# Altium schematic sheet BPDC mid.SchDoc
size A
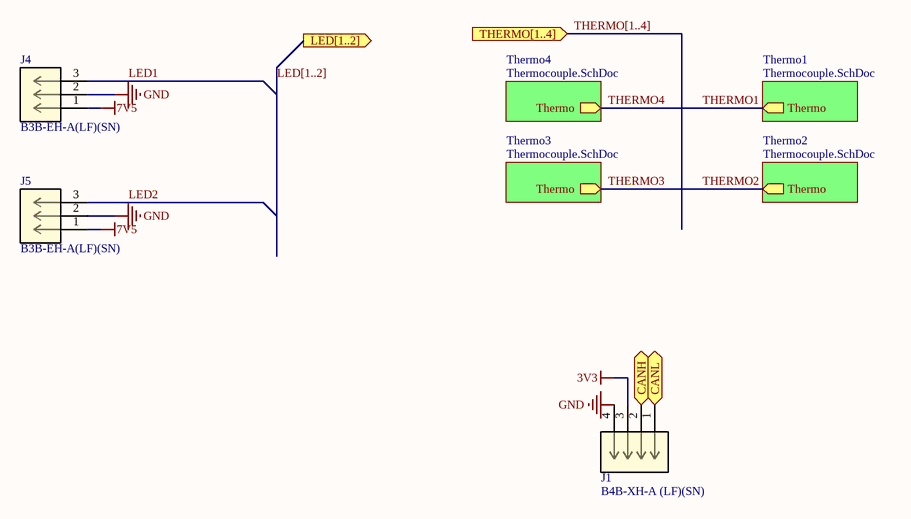
[diagram p0: BPDC mid.SchDoc]

## Parts
J1  B4B-XH-A (LF)(SN)  [CONN_B4B-XH-A (LF)(SN)_JST]
J4  B3B-EH-A(LF)(SN)  [CONN3_B3B-EH-A(LF)(SN)_JST]
J5  B3B-EH-A(LF)(SN)  [CONN3_B3B-EH-A(LF)(SN)_JST]

## Sub-sheets
Thermo1 = Thermocouple.SchDoc: Thermo (out)
Thermo2 = Thermocouple.SchDoc: Thermo (out)
Thermo3 = Thermocouple.SchDoc: Thermo (out)
Thermo4 = Thermocouple.SchDoc: Thermo (out)

## Ports
CANH (bidir), CANL (bidir), LED[1..2] (out), THERMO[1..4] (in)

## Nets
3V3: J1.3
7V5: J4.1 J5.1
GND: J1.4 J4.2 J5.2
CANH: J1.2 ; port CANH
CANL: J1.1 ; port CANL
LED1: J4.3
LED2: J5.3
THERMO1: sheet Thermo1/Thermo, sheet Thermo4/Thermo  [also labelled THERMO4]
THERMO2: sheet Thermo2/Thermo, sheet Thermo3/Thermo  [also labelled THERMO3]

## Buses and harness runs
bus LED[1..2] = port LED[1..2]
bus THERMO[1..4] = port THERMO[1..4]

## Library data of the parts
J1 = B4B-XH-A (LF)(SN): No Description Available; Vendor: JST; Built_By: EMA_Cory; SourceLibrary: JST_2020-02-03; Datasheet: http://www.jst-mfg.com/product/pdf/eng/eXH.pdf; Manufacturer_Part_Number: B4B-XH-A (LF)(SN); Copyright: Copyright (C) 2018 Accelerated Designs. All rights reserved; RefDes: RefDes; Type: DEV
J4 J5 = B3B-EH-A(LF)(SN): No Description Available; Vendor: JST; Built_By: EMA_Kyle; SourceLibrary: JST_2020-07-31; Datasheet: http://www.jst-mfg.com/product/pdf/eng/eEH.pdf; Manufacturer_Part_Number: B3B-EH-A(LF)(SN); Copyright: Copyright (C) 2018 Accelerated Designs. All rights reserved; RefDes: RefDes; Type: DEV